# Altium project CAMERA.PrjPcb (part 3 of 3)
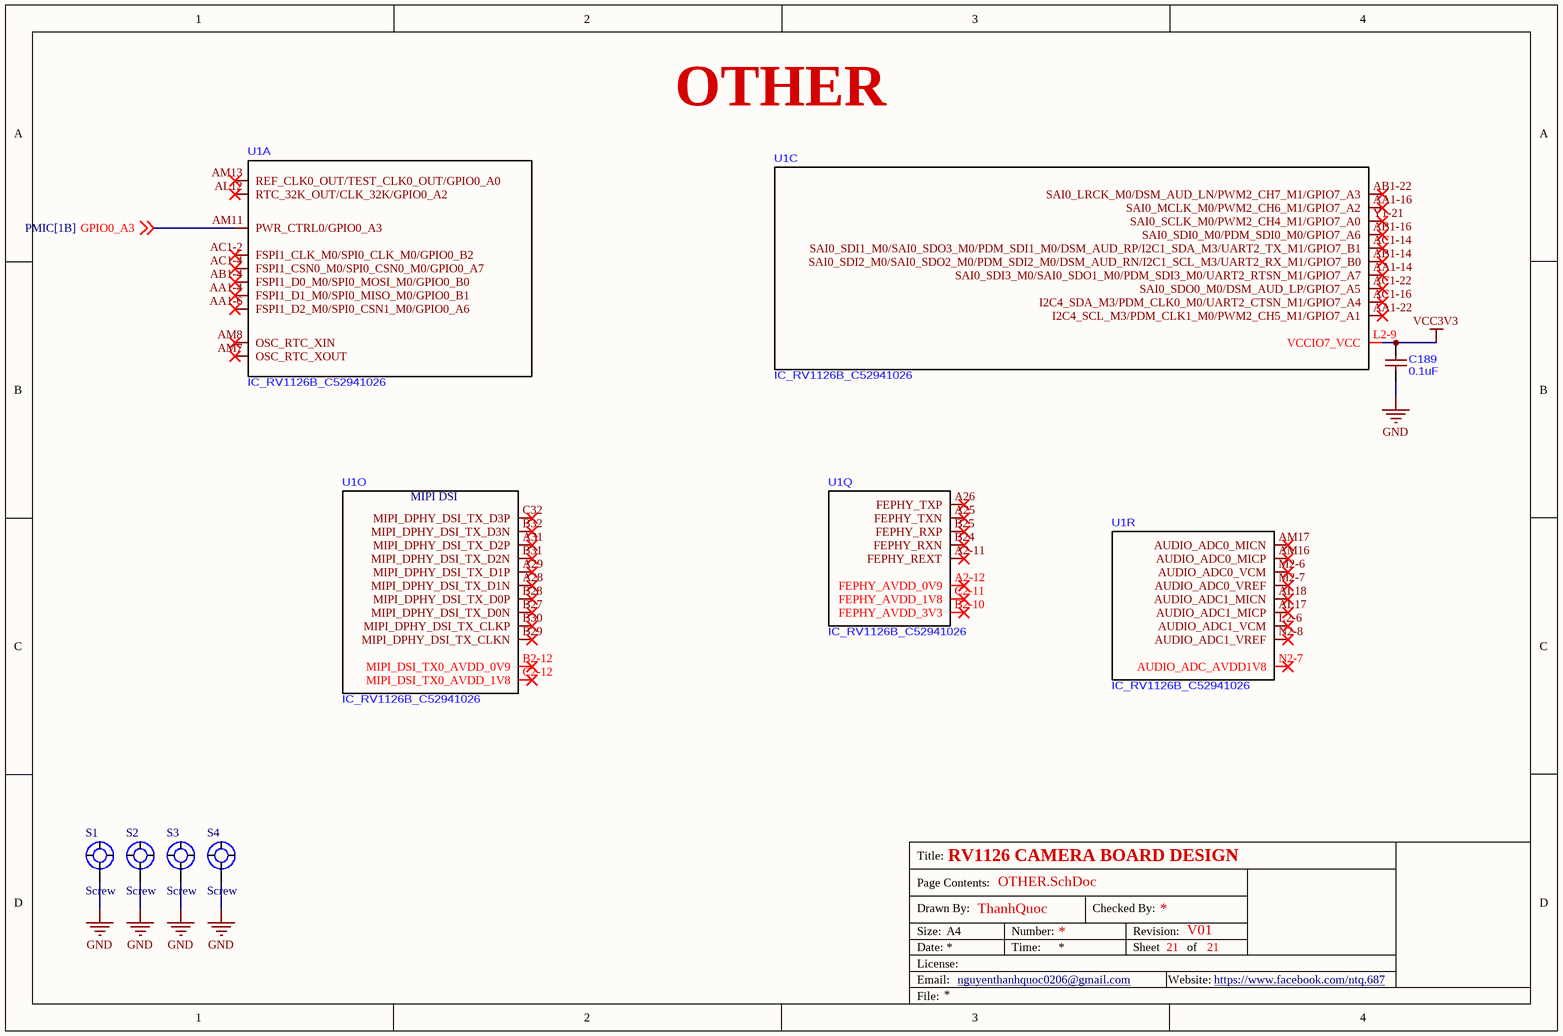
[diagram p21: OTHER.SchDoc]

## Nets that join several sheets
0V9: PMIC (C39.2 IC4.19), USB 2.0 CONTROLLER (C154.2 U1.M2-1), MIPI_CSI (C161.2 C162.2 U1.K2-12 U1.L2-12)
3V3SYS: PWR_IN (11 pins), PMIC (11 pins), PMUIO_BLOCK (6 pins), RGMII_PHY (L10.1 L11.1 R74.2)
5VIN: PWR_IN (6 pins), Connector (13 pins)
5VSYS: PWR_IN (7 pins), PMIC (15 pins), SDMMC RV1126B (C139.2 IC5.1)
GND: PWR_IN (32 pins), PMIC (24 pins), Power Pins Page RV1126 (169 pins), PMUIO_BLOCK (13 pins), SDRAM RV1126B (7 pins), LPDDR4X SDRAM (106 pins), RV1126B EMMC (C125.1), EMMC CHIP (23 pins), SDMMC RV1126B (8 pins), SDCARD (18 pins), SDMMC1 (C147.1 R47.1), SARADC (5 pins), USB 2.0 CONTROLLER (9 pins), CANFD (5 pins), MIPI_CSI (7 pins), RGMII (C165.1 C166.1), RGMII_PHY (20 pins), Connector (17 pins), OTHER (5 pins)
VCC0V6_DDR: PWR_IN (C16.2 IC3.5 L3.2), SDRAM RV1126B (C75.2 C77.2 U1.E2-4 U1.F2-4), LPDDR4X SDRAM (38 pins)
VCC0V9: PWR_IN (C13.2 C14.2 L2.2 R4.2), PMUIO_BLOCK (C62.2 C64.2 U1.K2-4 U1.K2-5)
VCC3V3: PMIC (C22.2 IC4.24), EMMC CHIP (9 pins), SDMMC RV1126B (R33.1), SDCARD (C146.2 Q3.2 R39.2), USB 2.0 CONTROLLER (C152.2 U1.K2-2), CANFD (6 pins), OTHER (C189.2 U1.L2-9)
VCC_1V8: PMIC (C38.2 IC4.16), Power Pins Page RV1126 (C42.2 U1.C2-13), PMUIO_BLOCK (C63.2 U1.J2-4), LPDDR4X SDRAM (16 pins), RV1126B EMMC (C125.2 R23.2 R24.2 U1.J2-2), EMMC CHIP (11 pins), SDMMC1 (C147.2 U1.B2-8), SARADC (L8.2 R50.1), USB 2.0 CONTROLLER (C153.2 U1.L2-2), MIPI_CSI (8 pins), RGMII (C165.2 L9.2 R70.2 U1.G2-12), RGMII_PHY (C169.2 IC6.28), Connector (C185.2 FPC1.30)
VCC_DDR: PMIC (C19.2 C20.2 L4.2 R9.2), SDRAM RV1126B (12 pins), LPDDR4X SDRAM (50 pins)
VDD_ARM: PMIC (C28.2 IC4.27 L5.2), Power Pins Page RV1126 (12 pins)
VDD_NPU: PMIC (5 pins), Power Pins Page RV1126 (11 pins)
VDD_VEPU_LOGIC: PWR_IN (5 pins), Power Pins Page RV1126 (14 pins)
CAM_CLK0: MIPI_CSI (R61.2), Connector (FPC1.18)
CAM_CLK1: MIPI_CSI (R60.2), Connector (FPC1.14)
CFG_LDO0: RGMII_PHY (IC6.33 R72.2), Connector (CN2.27)
CFG_LDO1: RGMII_PHY (IC6.34 R71.2), Connector (CN2.29)
DDR_RESET: SDRAM RV1126B (U1.A2-1), LPDDR4X SDRAM (U2.T11)
DDRA_A0: SDRAM RV1126B (U1.B8), LPDDR4X SDRAM (U2.H2)
DDRA_A1: SDRAM RV1126B (U1.C1-4), LPDDR4X SDRAM (U2.J2)
DDRA_A2: SDRAM RV1126B (U1.A1-12), LPDDR4X SDRAM (U2.H9)
DDRA_A3: SDRAM RV1126B (U1.B14), LPDDR4X SDRAM (U2.H10)
DDRA_A4: SDRAM RV1126B (U1.B1-12), LPDDR4X SDRAM (U2.H11)
DDRA_A5: SDRAM RV1126B (U1.A11), LPDDR4X SDRAM (U2.J11)
DDRA_CKE0: SDRAM RV1126B (U1.A10), LPDDR4X SDRAM (U2.J4)
DDRA_CKE1: SDRAM RV1126B (U1.B13), LPDDR4X SDRAM (U2.J5)
DDRA_CLK_N: SDRAM RV1126B (U1.C1-10), LPDDR4X SDRAM (U2.J9)
DDRA_CLK_P: SDRAM RV1126B (U1.B1-10), LPDDR4X SDRAM (U2.J8)
DDRA_CS0: SDRAM RV1126B (U1.B11), LPDDR4X SDRAM (U2.H4)
DDRA_CS1: SDRAM RV1126B (U1.A7), LPDDR4X SDRAM (U2.H3)
DDRA_D0: SDRAM RV1126B (U1.Y2), LPDDR4X SDRAM (U2.B2)
DDRA_D1: SDRAM RV1126B (U1.W1), LPDDR4X SDRAM (U2.C2)
DDRA_D2: SDRAM RV1126B (U1.V1), LPDDR4X SDRAM (U2.E2)
DDRA_D3: SDRAM RV1126B (U1.V2), LPDDR4X SDRAM (U2.F2)
DDRA_D4: SDRAM RV1126B (U1.AE1), LPDDR4X SDRAM (U2.F4)
DDRA_D5: SDRAM RV1126B (U1.AD1), LPDDR4X SDRAM (U2.E4)
DDRA_D6: SDRAM RV1126B (U1.AD2), LPDDR4X SDRAM (U2.C4)
DDRA_D7: SDRAM RV1126B (U1.AC2), LPDDR4X SDRAM (U2.B4)
DDRA_D8: SDRAM RV1126B (U1.R1), LPDDR4X SDRAM (U2.B11)
DDRA_D9: SDRAM RV1126B (U1.M1-3), LPDDR4X SDRAM (U2.C11)
DDRA_D10: SDRAM RV1126B (U1.R2), LPDDR4X SDRAM (U2.E11)
DDRA_D11: SDRAM RV1126B (U1.H1-1), LPDDR4X SDRAM (U2.F11)
DDRA_D12: SDRAM RV1126B (U1.T2), LPDDR4X SDRAM (U2.F9)
DDRA_D13: SDRAM RV1126B (U1.T1), LPDDR4X SDRAM (U2.E9)
DDRA_D14: SDRAM RV1126B (U1.H1-3), LPDDR4X SDRAM (U2.C9)
DDRA_D15: SDRAM RV1126B (U1.P1-1), LPDDR4X SDRAM (U2.B9)
DDRA_DM0: SDRAM RV1126B (U1.W2), LPDDR4X SDRAM (U2.C3)
DDRA_DM1: SDRAM RV1126B (U1.M1-1), LPDDR4X SDRAM (U2.C10)
DDRA_DQS0_N: SDRAM RV1126B (U1.AA1), LPDDR4X SDRAM (U2.E3)
DDRA_DQS0_P: SDRAM RV1126B (U1.AB1), LPDDR4X SDRAM (U2.D3)
DDRA_DQS1_N: SDRAM RV1126B (U1.K1-2), LPDDR4X SDRAM (U2.E10)
DDRA_DQS1_P: SDRAM RV1126B (U1.K1-1), LPDDR4X SDRAM (U2.D10)
DDRB_A0: SDRAM RV1126B (U1.A1-4), LPDDR4X SDRAM (U2.R2)
DDRB_A1: SDRAM RV1126B (U1.B4), LPDDR4X SDRAM (U2.P2)
DDRB_A2: SDRAM RV1126B (U1.A4), LPDDR4X SDRAM (U2.R9)
DDRB_A3: SDRAM RV1126B (U1.A5), LPDDR4X SDRAM (U2.R10)
DDRB_A4: SDRAM RV1126B (U1.B5), LPDDR4X SDRAM (U2.R11)
DDRB_A5: SDRAM RV1126B (U1.A1-6), LPDDR4X SDRAM (U2.P11)
DDRB_CKE0: SDRAM RV1126B (U1.C1-8), LPDDR4X SDRAM (U2.P4)
DDRB_CKE1: SDRAM RV1126B (U1.C1-6), LPDDR4X SDRAM (U2.P5)
DDRB_CLK_N: SDRAM RV1126B (U1.A1-2), LPDDR4X SDRAM (U2.P9)
DDRB_CLK_P: SDRAM RV1126B (U1.B1-2), LPDDR4X SDRAM (U2.P8)
DDRB_CS0: SDRAM RV1126B (U1.B7), LPDDR4X SDRAM (U2.R4)
DDRB_CS1: SDRAM RV1126B (U1.A14), LPDDR4X SDRAM (U2.R3)
DDRB_D0: SDRAM RV1126B (U1.M2), LPDDR4X SDRAM (U2.AA2)
DDRB_D1: SDRAM RV1126B (U1.M1), LPDDR4X SDRAM (U2.Y2)
DDRB_D2: SDRAM RV1126B (U1.N1), LPDDR4X SDRAM (U2.V2)
DDRB_D3: SDRAM RV1126B (U1.N2), LPDDR4X SDRAM (U2.U2)
DDRB_D4: SDRAM RV1126B (U1.H2), LPDDR4X SDRAM (U2.U4)
DDRB_D5: SDRAM RV1126B (U1.J2), LPDDR4X SDRAM (U2.V4)
DDRB_D6: SDRAM RV1126B (U1.J1), LPDDR4X SDRAM (U2.Y4)
DDRB_D7: SDRAM RV1126B (U1.K1), LPDDR4X SDRAM (U2.AA4)
DDRB_D8: SDRAM RV1126B (U1.C1), LPDDR4X SDRAM (U2.AA11)
DDRB_D9: SDRAM RV1126B (U1.B1), LPDDR4X SDRAM (U2.Y11)
DDRB_D10: SDRAM RV1126B (U1.A2), LPDDR4X SDRAM (U2.V11)
DDRB_D11: SDRAM RV1126B (U1.B2), LPDDR4X SDRAM (U2.U11)
DDRB_D12: SDRAM RV1126B (U1.G1), LPDDR4X SDRAM (U2.U9)
DDRB_D13: SDRAM RV1126B (U1.F1), LPDDR4X SDRAM (U2.V9)
DDRB_D14: SDRAM RV1126B (U1.F2), LPDDR4X SDRAM (U2.Y9)
DDRB_D15: SDRAM RV1126B (U1.E2), LPDDR4X SDRAM (U2.AA9)
DDRB_DM0: SDRAM RV1126B (U1.K2), LPDDR4X SDRAM (U2.Y3)
DDRB_DM1: SDRAM RV1126B (U1.D2), LPDDR4X SDRAM (U2.Y10)
DDRB_DQS0_N: SDRAM RV1126B (U1.F1-2), LPDDR4X SDRAM (U2.V3)
DDRB_DQS0_P: SDRAM RV1126B (U1.F1-1), LPDDR4X SDRAM (U2.W3)
DDRB_DQS1_N: SDRAM RV1126B (U1.D1-2), LPDDR4X SDRAM (U2.V10)
DDRB_DQS1_P: SDRAM RV1126B (U1.D1-1), LPDDR4X SDRAM (U2.W10)
EMMC_CLK: RV1126B EMMC (R25.2), EMMC CHIP (U3.M6)
EMMC_CMD: RV1126B EMMC (R23.1 U1.AG1), EMMC CHIP (U3.M5)
EMMC_D0: RV1126B EMMC (R24.1 U1.AL1), EMMC CHIP (U3.A3)
EMMC_D1: RV1126B EMMC (U1.V1-3), EMMC CHIP (U3.A4)
EMMC_D2: RV1126B EMMC (U1.V1-2), EMMC CHIP (U3.A5)
EMMC_D3: RV1126B EMMC (U1.AK2), EMMC CHIP (U3.B2)
EMMC_D4: RV1126B EMMC (U1.AK1), EMMC CHIP (U3.B3)
EMMC_D5: RV1126B EMMC (U1.AJ2), EMMC CHIP (U3.B4)
EMMC_D6: RV1126B EMMC (U1.AH2), EMMC CHIP (U3.B5)
EMMC_D7: RV1126B EMMC (U1.AH1), EMMC CHIP (U3.B6)
ETH_CLK_25M: RGMII (R68.2), RGMII_PHY (IC6.37)
ETH_MDC_M0: RGMII (R67.2), RGMII_PHY (IC6.13)
ETH_MDIO: RGMII (R70.1 U1.K1-21), RGMII_PHY (IC6.14)
ETH_RX0_M0: RGMII (U1.P1-22), RGMII_PHY (R78.2)
ETH_RX1_M0: RGMII (U1.P1-23), RGMII_PHY (R79.2)
ETH_RX2_M0: RGMII (U1.AC31), RGMII_PHY (R80.2)
ETH_RX3_M0: RGMII (U1.AB31), RGMII_PHY (R81.2)
ETH_RXCLK_M0: RGMII (U1.V31), RGMII_PHY (R76.2)
ETH_RXCTL_M0: RGMII (U1.M1-22), RGMII_PHY (R77.2)
ETH_TX0_M0: RGMII (R64.2), RGMII_PHY (IC6.18)
ETH_TX1_M0: RGMII (R65.2), RGMII_PHY (IC6.17)
ETH_TX2_M0: RGMII (R62.2), RGMII_PHY (IC6.16)
ETH_TX3_M0: RGMII (R63.2), RGMII_PHY (IC6.15)
ETH_TXCLK_M0: RGMII (R69.2), RGMII_PHY (IC6.20)
ETH_TXCTL_M0: RGMII (R66.2), RGMII_PHY (IC6.19)
GPIO0_A3: PMIC (IC4.11), OTHER (U1.AM11)
GPIO0_C1_d: PWR_IN (IC1.A1), PMUIO_BLOCK (U1.AC1-10)
GPIO4_A2_PWND0: MIPI_CSI (U1.Y1-23), Connector (FPC1.22)
GPIO4_A3_RST0: MIPI_CSI (C158.2 U1.V1-21), Connector (FPC1.24)
GPIO4_A4_PWND1: MIPI_CSI (U1.V1-22), Connector (FPC1.26)
GPIO4_A5_RST1: MIPI_CSI (C159.2 U1.AF32), Connector (FPC1.28)
I2C1_SCL_M2: MIPI_CSI (R58.1 U1.AG32), Connector (FPC1.10)
I2C1_SDA_M2: MIPI_CSI (R59.1 U1.AG31), Connector (FPC1.8)
INT: PMIC (IC4.7 R11.1), PMUIO_BLOCK (U1.AB1-6)
MDI0_N: RGMII_PHY (IC6.2), Connector (CN2.14)
MDI0_P: RGMII_PHY (IC6.1), Connector (CN2.16)
MDI1_N: RGMII_PHY (IC6.5), Connector (CN2.10)
MDI1_P: RGMII_PHY (IC6.4), Connector (CN2.12)
MDI2_N: RGMII_PHY (IC6.7), Connector (CN2.6)
MDI2_P: RGMII_PHY (IC6.6), Connector (CN2.8)
MDI3_N: RGMII_PHY (IC6.10), Connector (CN2.2)
MDI3_P: RGMII_PHY (IC6.9), Connector (CN2.4)
MIPI_CSI_RX0_CLK0_N: MIPI_CSI (U1.AL23), Connector (FPC1.19)
MIPI_CSI_RX0_CLK0_P: MIPI_CSI (U1.AM23), Connector (FPC1.21)
MIPI_CSI_RX0_D0_N: MIPI_CSI (U1.AM26), Connector (FPC1.1)
MIPI_CSI_RX0_D0_P: MIPI_CSI (U1.AM25), Connector (FPC1.3)
MIPI_CSI_RX0_D1_N: MIPI_CSI (U1.AL25), Connector (FPC1.5)
MIPI_CSI_RX0_D1_P: MIPI_CSI (U1.AL24), Connector (FPC1.7)
MIPI_CSI_RX0_D2_N: MIPI_CSI (U1.AM20), Connector (FPC1.9)
MIPI_CSI_RX0_D2_P: MIPI_CSI (U1.AM19), Connector (FPC1.11)
MIPI_CSI_RX0_D3_N: MIPI_CSI (U1.AL21), Connector (FPC1.13)
MIPI_CSI_RX0_D3_P: MIPI_CSI (U1.AL20), Connector (FPC1.15)
MIPI_CSI_RX1_CLK0_N: MIPI_CSI (U1.AM31), Connector (FPC1.4)
MIPI_CSI_RX1_CLK0_P: MIPI_CSI (U1.AL31), Connector (FPC1.2)
MIPI_CSI_RX1_D0_N: MIPI_CSI (U1.AJ31), Connector (FPC1.25)
MIPI_CSI_RX1_D0_P: MIPI_CSI (U1.AJ32), Connector (FPC1.27)
MIPI_CSI_RX1_D1_N: MIPI_CSI (U1.AK32), Connector (FPC1.29)
MIPI_CSI_RX1_D1_P: MIPI_CSI (U1.AL32), Connector (FPC1.31)
MIPI_CSI_RX1_D2_N: MIPI_CSI (U1.AL28), Connector (FPC1.33)
MIPI_CSI_RX1_D2_P: MIPI_CSI (U1.AL27), Connector (FPC1.35)
MIPI_CSI_RX1_D3_N: MIPI_CSI (U1.AM29), Connector (FPC1.37)
MIPI_CSI_RX1_D3_P: MIPI_CSI (U1.AM28), Connector (FPC1.39)
RESET: PMIC (C41.2 IC4.4 R14.1), PMUIO_BLOCK (U1.AL11 U1.AL13)
RGMII_INT: RGMII (U1.T1-23), RGMII_PHY (R75.2)
RSTB: RGMII (U1.AD32), RGMII_PHY (C170.1 IC6.12)
SCL: PWR_IN (IC1.A3), PMIC (IC4.2 R12.1), PMUIO_BLOCK (U1.AA1-8)
SDA: PWR_IN (IC1.B1), PMIC (IC4.3 R13.1), PMUIO_BLOCK (U1.AC1-6)
SDMMC0_CLK: SDMMC RV1126B (R32.2), SDCARD (D7.2 SD1.5)
SDMMC0_CMD: SDMMC RV1126B (R31.2), SDCARD (D6.2 SD1.3)
SDMMC0_D0: SDMMC RV1126B (R30.2), SDCARD (D11.2 SD1.7)
SDMMC0_D1: SDMMC RV1126B (R29.2), SDCARD (D10.2 SD1.8)
SDMMC0_D2: SDMMC RV1126B (R28.2), SDCARD (D9.2 SD1.1)
SDMMC0_D3: SDMMC RV1126B (R27.2), SDCARD (D8.2 SD1.2)
SDMMC0_DETN: PMUIO_BLOCK (R19.2), SDCARD (D5.2 SD1.9)
SDMMC0_PWREN: SDCARD (R40.1), CANFD (U1.D31)
SDMMC0_VOL_CTRL: SDMMC RV1126B (R36.1), CANFD (U1.R31)
SDMMC1_CLK: SDMMC1 (R46.2), Connector (CN2.1)
USB_DRD_N: USB 2.0 CONTROLLER (R52.2), Connector (CN2.21)
USB_DRD_P: USB 2.0 CONTROLLER (R51.2), Connector (CN2.23)
USB_HOST_N: USB 2.0 CONTROLLER (R54.2), Connector (CN2.17)
USB_HOST_P: USB 2.0 CONTROLLER (R53.2), Connector (CN2.19)
USB_VBUS: USB 2.0 CONTROLLER (R55.2), Connector (CN2.25)